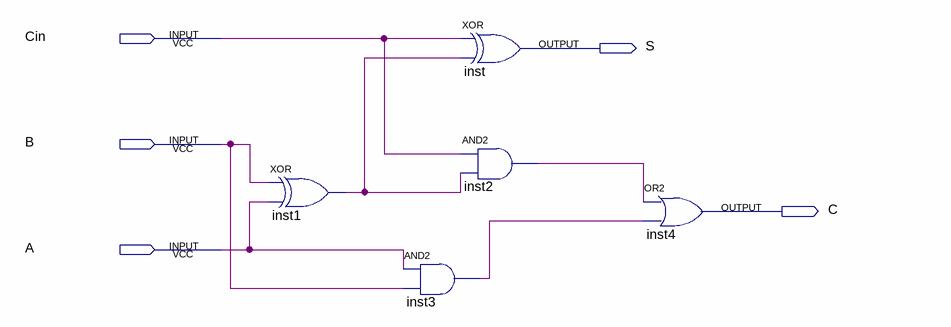
[diagram p0: schematic sheet]
// Quartus schematic somador.bdf as structural Verilog: 5 symbols, 5 pins
module somador (
  input  Cin,
  input  B,
  input  A,
  output S,
  output C
);

  wire inst1_out, inst2_out, inst3_out;

  xor inst1 (inst1_out, B, A);
  and inst3 (inst3_out, A, B);
  xor inst (S, Cin, inst1_out);
  and inst2 (inst2_out, Cin, inst1_out);
  or inst4 (C, inst2_out, inst3_out);
endmodule
